# EasyEDA Pro project 校内赛载板最终版.eprj

# Schematic Schematic1
Board Name: Board1; Create Date: 2024-11-15; Page Name: P1; Project Name: 校内赛载板; Schematic Name: Schematic1; Update Date: 2024-12-04; Company: 韩广洋; Page Size: A4; Version: V1.0
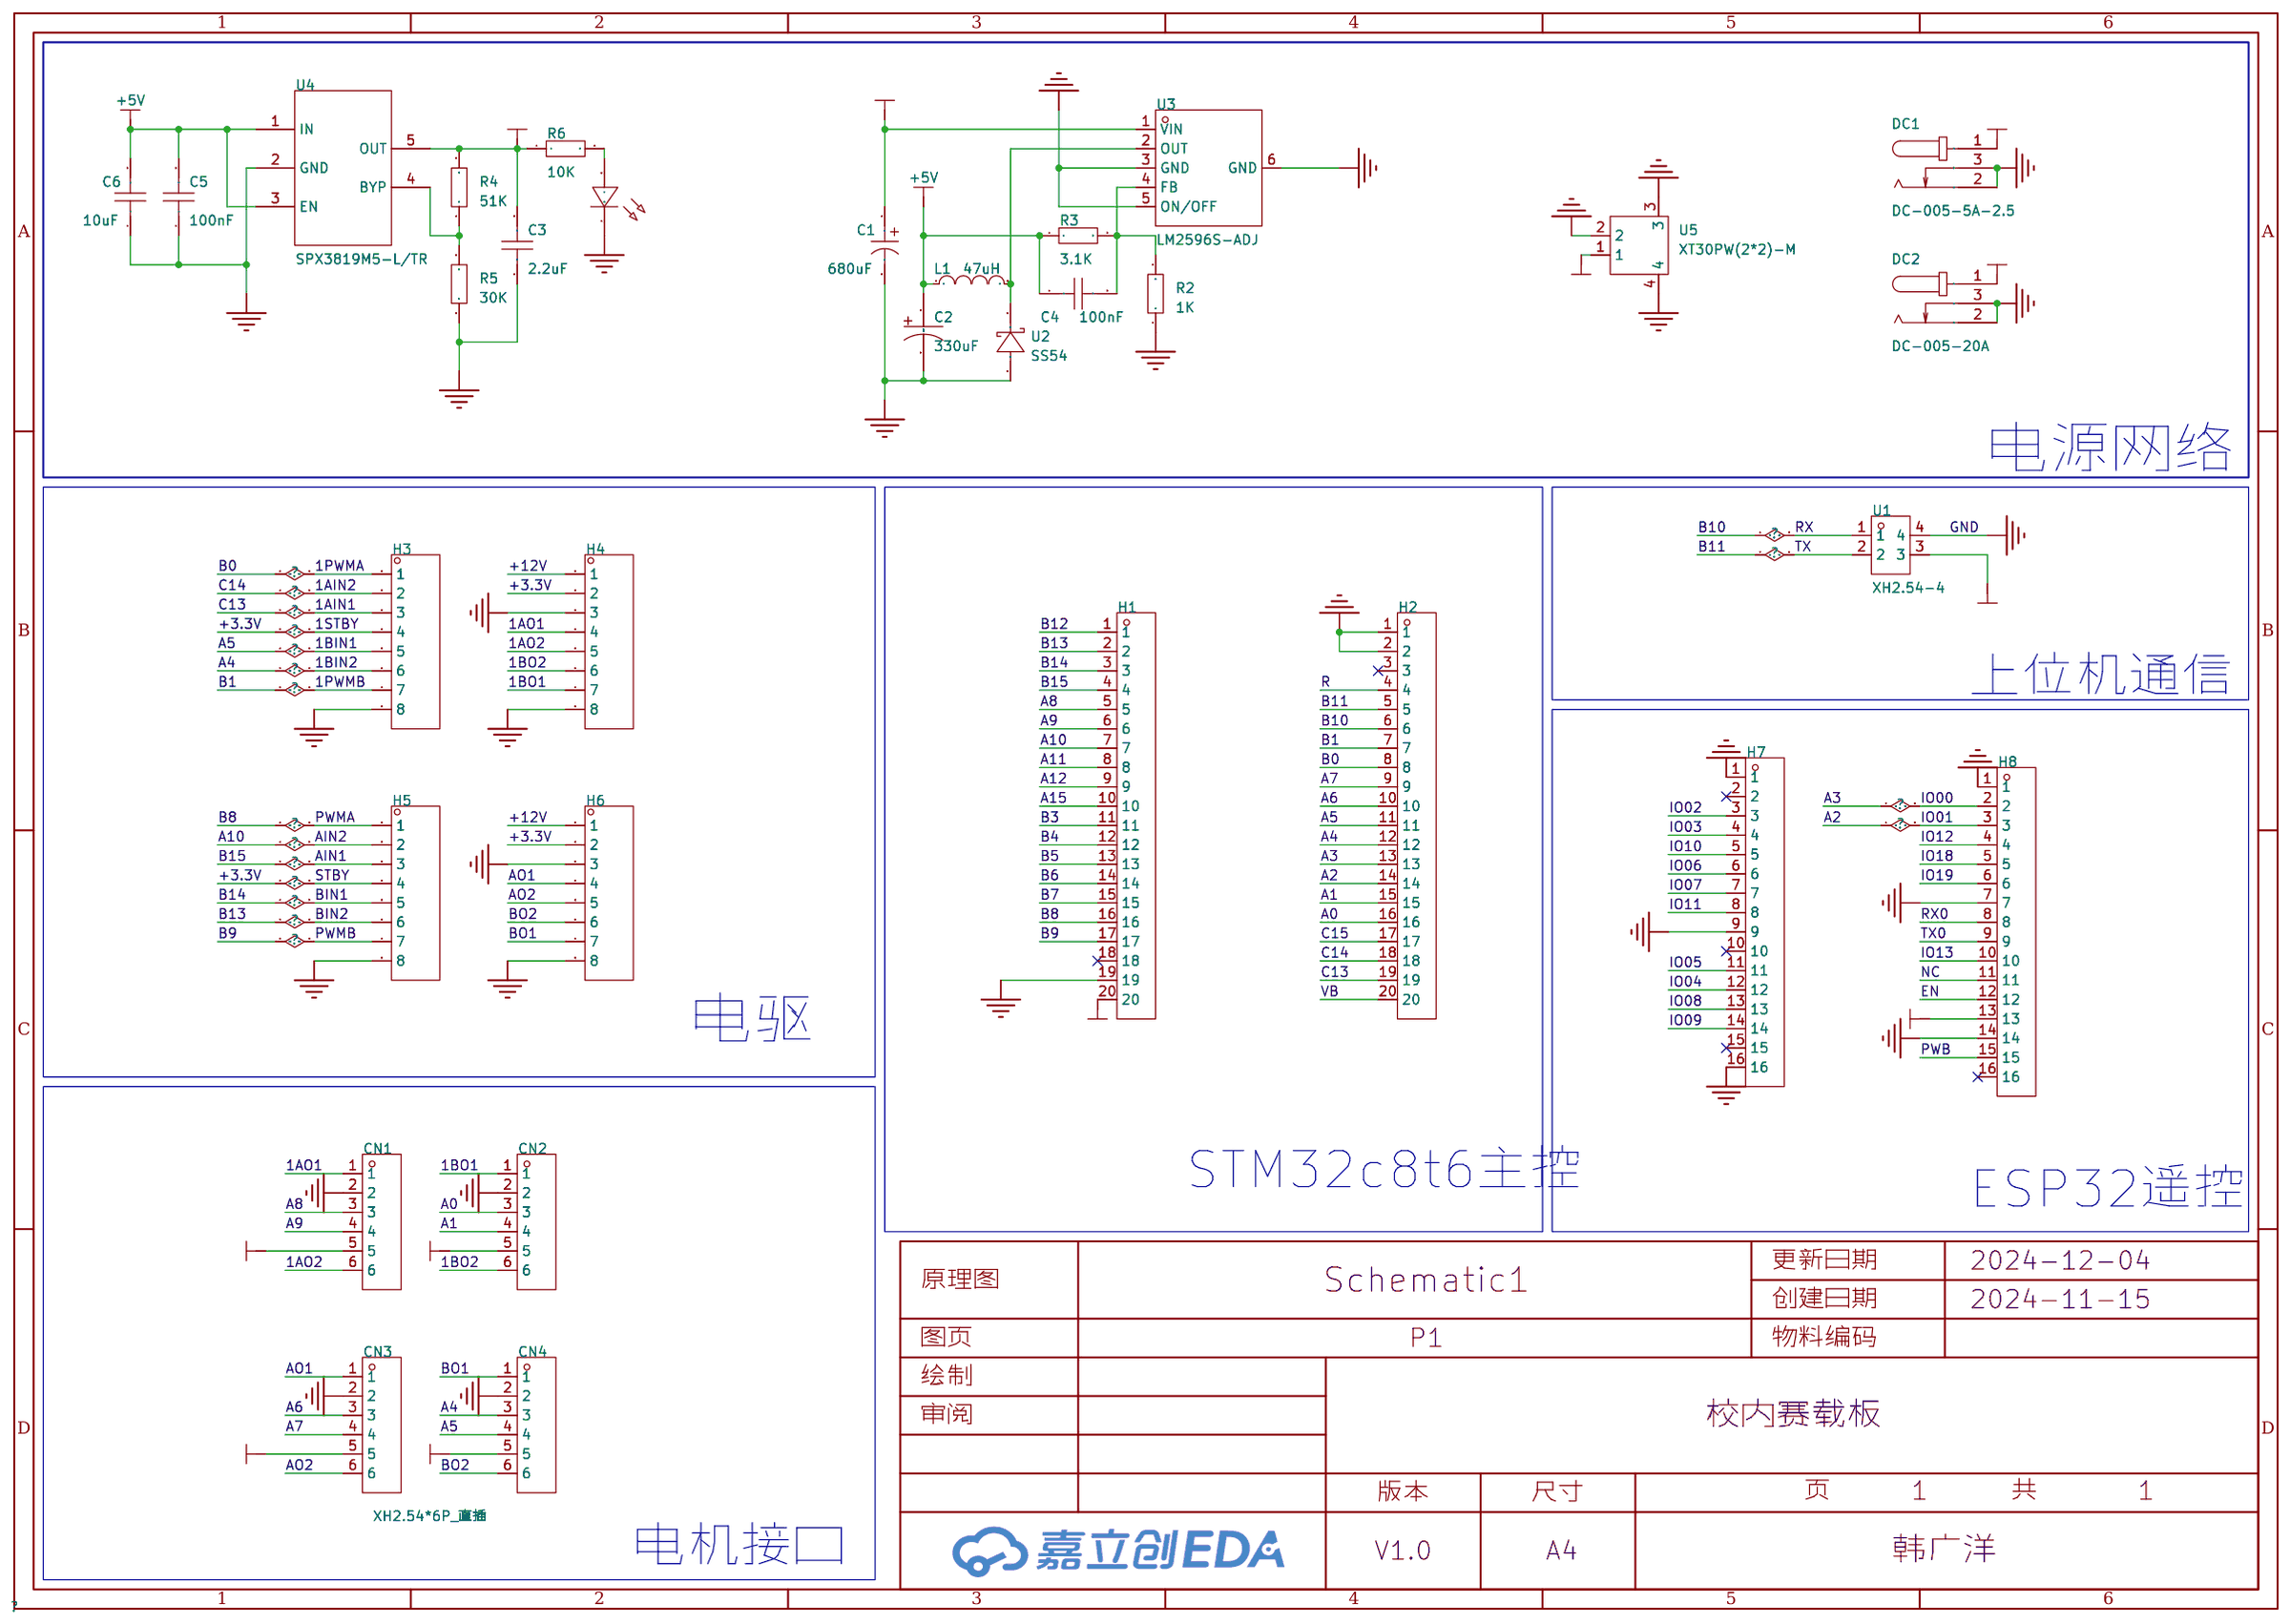
[diagram p0: schematic sheet]

## Parts
C1  680uF  [CAP-SMD_BD16.0-L17.0-W17.0-LS18.0-FD]
C2  330uF  [CAP-SMD_BD8.0-L8.3-W8.3-LS9.3-FD-1]
C3  2.2uF  [C0603]
C4  100nF  [C0603]
C5  100nF  [C0603]
C6  10uF  [C0603]
CN1  XH2.54*6P_直插  [CONN-TH_XH2.54-6P]
CN2  XH2.54*6P_直插  [CONN-TH_XH2.54-6P]
CN3  XH2.54*6P_直插  [CONN-TH_XH2.54-6P]
CN4  XH2.54*6P_直插  [CONN-TH_XH2.54-6P]
DC1  DC-005-5A-2.5  [DC-IN-TH_DC-005-5A-2.5]
DC2  DC-005-20A  [DC-IN-TH_DC005]
H1  -  [HDR-TH_20P-P2.54-V-M-1]
H2  -  [HDR-TH_20P-P2.54-V-M-1]
H3  -  [HDR-TH_8P-P2.54-V-M]
H4  -  [HDR-TH_8P-P2.54-V-M]
H5  -  [HDR-TH_8P-P2.54-V-M]
H6  -  [HDR-TH_8P-P2.54-V-M]
H7  -  [HDR-TH_16P-P2.54-V-M]
H8  -  [HDR-TH_16P-P2.54-V-M]
L1  47uH  [IND-SMD_L11.5-W10.0_SMMS1040]
power1  -  [LED_0603]
R2  1K  [R0603]
R3  3.1K  [R0603]
R4  51K  [R0603]
R5  30K  [R0603]
R6  10K  [R0603]
U1  XH2.54-4  [CONN-TH_4P-P2.50_XH2.54-4]
U2  SS54  [SMB_L4.3-W3.6-LS5.4-RD]
U3  LM2596S-ADJ  [TO-263-5_L10.0-W8.4-P1.70-LS15.3-BR]
U4  SPX3819M5-L/TR  [SOT-23-5_L3.0-W1.7-P0.95-LS2.8-TL]
U5  XT30PW(2*2)-M  [CONN-TH_XT30PW-M]

## Library data of the parts
C1 = EEVFK1H681M: 容值:680uF;精度:±20%;额定电压:50V;纹波电流:1.208A@120Hz;等效串联电阻:-;; LCSC Part Name: 680uF ±20% 50V; Supplier Part: C401970; Manufacturer: PANASONIC(松下); Supplier Footprint: SMD; JLCPCB Part Class: 扩展库; Datasheet: https://atta.szlcsc.com/upload/public/pdf/source/20190702/C401970_913ED576C1BD808CA41B229867A4EED0.pdf; Supplier: LCSC; Tolerance: ±20%; Rated Voltage: 50V; Ripple Current: 1.208A@120Hz; Lifetime @ Temp: 5000hrs@105℃; Operating Temperature: -55℃~+105℃
C2 = RVT1E331M0810_C335985: 容值:330uF;精度:±20%;额定电压:25V;纹波电流:228mA@120Hz;等效串联电阻:-;; LCSC Part Name: 330uF ±20% 25V; Supplier Part: C335985; Manufacturer: ROQANG(容强); Manufacturer Part: RVT1E331M0810; Supplier Footprint: SMD,D8xL10.2mm; Datasheet: https://atta.szlcsc.com/upload/public/pdf/source/20181128/C335987_23CA7AA50FB42690DF736C43FE112376.pdf; Supplier: LCSC; Tolerance: ±20%; Rated Voltage: 25V; Ripple Current: 228mA@120Hz; φD: 8mm; L: 10.2mm; Lifetime @ Temp: 2000hrs@105℃; Operating Temperature: -40℃~+105℃
C3-C6 = CAP_0603: Supplier Footprint: 0603
CN1-CN4 = XH2.54*6P_直插: Supplier Part: C9900008614; Supplier Footprint: XH2.54_6P; JLCPCB Part Class: 扩展库; Supplier: LCSC
DC1 = DC-005-5A-2.5: LCSC Part Name: DC电源插座 内径:2.5mm 外径:6.5mm; Supplier Part: C381115; Manufacturer: XKB Connection(中国星坤); Supplier Footprint: 插件; JLCPCB Part Class: 扩展库; Datasheet: https://atta.szlcsc.com/upload/public/pdf/source/20220930/9F6B678D272419D8FE16D336E354A545.pdf; Supplier: LCSC; Connector Type: DC电源插座; Mounting Style: 弯插; Inside Contact Diameter: 2.5mm; Outside Contact Diameter: 6.5mm; Current Rating (Max): 5A; Voltage Rating (Max): 24V; Operating Temperature Range: -20℃~+70℃
DC2 = DC-005-20A: LCSC Part Name: DC电源插座 内径:2mm 外径:6.4mm; Supplier Part: C130239; Manufacturer: 韩国韩荣; Supplier Footprint: 插件; JLCPCB Part Class: 扩展库; Datasheet: https://atta.szlcsc.com/upload/public/pdf/source/20210810/D1FE451D887B1804F0660F580C4AD849.pdf; Supplier: LCSC; Connector Type: DC电源插座; Mounting Style: 弯插; Inside Contact Diameter: 2mm; Outside Contact Diameter: 6.4mm; Current Rating (Max): 500mA; Voltage Rating (Max): 30V; Operating Temperature Range: -25℃~+80℃
H1 H2 = HDR-M_2.54_1x20P: Supplier Part: C50981; Supplier Footprint: 插件
H3-H6 = HDR-M_2.54_1x8P: Supplier Part: C124381; Supplier Footprint: 插件
H7 H8 = HDR-M_2.54_1x16P: Supplier Part: C2894939; Supplier Footprint: 插件
L1 = SMMS1040-470M: 电感值:47uH;精度:±20%;额定电流:3A;饱和电流(Isat):4.5A;类型:一体成型电感;; LCSC Part Name: 47uH ±20% 4.5A; Supplier Part: C149599; Manufacturer: SXN(顺翔诺); JLCPCB Part Class: 扩展库; Datasheet: https://atta.szlcsc.com/upload/public/pdf/source/20210810/BBF24330FB2F5029F637830BA9C42C0D.pdf; Supplier: LCSC; Tolerance: ±20%; Rated Current: 3A; Saturation Current (Isat): 4.5A; DC Resistance (DCR): 155mΩ; Type: 一体成型电感
power1 = LED_0603-B: Supplier Footprint: 0603
R2-R6 = Res_0603: Supplier Footprint: 0603
U1 = XH2.54-4_C9900009491: Supplier Part: C9900009491; Supplier Footprint: RS485接口; JLCPCB Part Class: 扩展库; Supplier: LCSC
U2 = SS54_C5200096: 二极管配置:独立式;正向压降(Vf):550mV@5A;直流反向耐压(Vr):40V;整流电流:5A;; LCSC Part Name: 电压:40V 电流:5A; Supplier Part: C5200096; Manufacturer: HXY MOSFET(华轩阳电子); Supplier Footprint: SMB; JLCPCB Part Class: 扩展库; Datasheet: https://atta.szlcsc.com/upload/public/pdf/source/20240729/0CDBC9DF1EA9FCC08D6B1D5092B6FBD2.pdf; Supplier: LCSC; Diode Configuration: 独立式; Forward Voltage (Vf@If): 550mV@5A; Reverse Voltage (Vr): 40V; Rectified Current: 5A; Reverse Leakage Current (Ir): 500uA
U3 = LM2596S-ADJ_C5349987: 功能类型:降压型;输出类型:可调;输入电压:40V;输出电压:1.23V~37V;输出电流(最大值):3.5A;; Supplier Part: C5349987; Manufacturer: HXY MOSFET(华轩阳电子); Supplier Footprint: TO-263-5L; JLCPCB Part Class: 扩展库; Datasheet: https://atta.szlcsc.com/upload/public/pdf/source/20230111/199BC35A7A4D0647B85E7DE5CE9FEA7F.pdf; Supplier: LCSC; Function: 降压型; Output Type: 可调; Input Voltage: 40V; Output Voltage: 1.23V~37V; Output Current (Max): 3.5A; Operating Temperature: -40℃~+125℃; Number of Outputs: 1; Switch tube (built-in/external): 内置
U4 = SPX3819M5-L/TR: 输出类型:可调;输出极性:正;输出通道数:1;最大输入电压:16V;输出电压:1.235V~15.3V;压差:700mV@(500mA);输出电流:500mA;电源纹波抑制比(PRSS):-;; LCSC Part Name: Vin=16V Vout=1.235V~15.3V 500mA; Supplier Part: C9056; Manufacturer: MaxLinear; Supplier Footprint: SOT-23-5; JLCPCB Part Class: Extended Part; Datasheet: https://atta.szlcsc.com/upload/public/pdf/source/20170918/C9056_1505727077801976524.pdf; Supplier: LCSC; Output Type: 可调; Output Polarity: 正; Number of Outputs: 1; Maximum Input Voltage: 16V; Output Voltage: 1.235V~15.3V; Dropout Voltage: 700mV@(500mA); Output Current: 500mA
U5 = XT30PW(2*2)-M: Supplier Part: C9900097120; JLCPCB Part Class: 扩展库; Supplier: LCSC

## Nets
+3.3V: C3.2 CN1.5 CN2.5 CN3.5 CN4.5 H1.20 H3.4 H4.2 H5.4 H6.2 H8.13 R4.2 R6.1 U1.3 U4.5(OUT)
+5V: C2.1 C4.1 C5.2 C6.2 L1.1 R3.1 U4.1(IN) U4.3(EN)
+12V: C1.1 DC1.1 DC2.1 H4.1 H6.1 U3.1(VIN) U5.1
GND: C1.2 C2.2 C3.1 C5.1 C6.1 CN1.2 CN2.2 CN3.2 CN4.2 DC1.2 DC1.3 DC2.2 DC2.3 H1.19 H2.1 H2.2 H3.8 H4.3 H4.8 H5.8 H6.3 H6.8 H7.1 H7.9 H7.16 H8.1 H8.7 H8.14 power1.1(C) R2.1 R5.1 U1.4 U2.2 U3.3(GND) U3.5(ON/OFF) U3.6(GND) U4.2(GND) U5.2 U5.3 U5.4
1AIN1: H2.19 H3.3
1AIN2: H2.18 H3.2
1AO1: CN1.1 H4.4
1AO2: CN1.6 H4.5
1BIN1: CN4.4 H2.11 H3.5
1BIN2: CN4.3 H2.12 H3.6
1BO1: CN2.1 H4.7
1BO2: CN2.6 H4.6
1PWMA: H2.8 H3.1
1PWMB: H2.7 H3.7
A0: CN2.3 H2.16
A1: CN2.4 H2.15
A2: H2.14 H8.3
A3: H2.13 H8.2
A6: CN3.3 H2.10
A7: CN3.4 H2.9
A8: CN1.3 H1.5
A9: CN1.4 H1.6
A10: H1.7 H5.2
A11: H1.8
A12: H1.9
A15: H1.10
AIN1: H1.4 H5.3
AO1: CN3.1 H6.4
AO2: CN3.6 H6.5
B3: H1.11
B4: H1.12
B5: H1.13
B6: H1.14
B7: H1.15
B8: H1.16 H5.1
B9: H1.17 H5.7
B10: H2.6 U1.1
B11: H2.5 U1.2
B12: H1.1
B13: H1.2 H5.6
B14: H1.3 H5.5
BO1: CN4.1 H6.7
BO2: CN4.6 H6.6
C15: H2.17
EN: H8.12
IO02: H7.3
IO03: H7.4
IO04: H7.12
IO05: H7.11
IO06: H7.6
IO07: H7.7
IO08: H7.13
IO09: H7.14
IO10: H7.5
IO11: H7.8
IO12: H8.4
IO13: H8.10
IO18: H8.5
IO19: H8.6
NC: H8.11
PWB: H8.15
R: H2.4
RX0: H8.8
TX0: H8.9
VB: H2.20
$1N12002: L1.2 U2.1 U3.2(OUT)
$1N12004: C4.2 R2.2 R3.2 U3.4(FB)
$1N12294: R4.1 R5.2 U4.4(BYP)
$1N12610: power1.2(A) R6.2

Not connected (* = marked no-connect by the designer): H1 18*; H2 3*; H7 2* 10* 15*; H8 16*

## Notes on the sheet
- 电源网络
- 上位机通信
- 电驱
- STM32c8t6主控
- ESP32遥控
- 电机接口

# Board PCB1
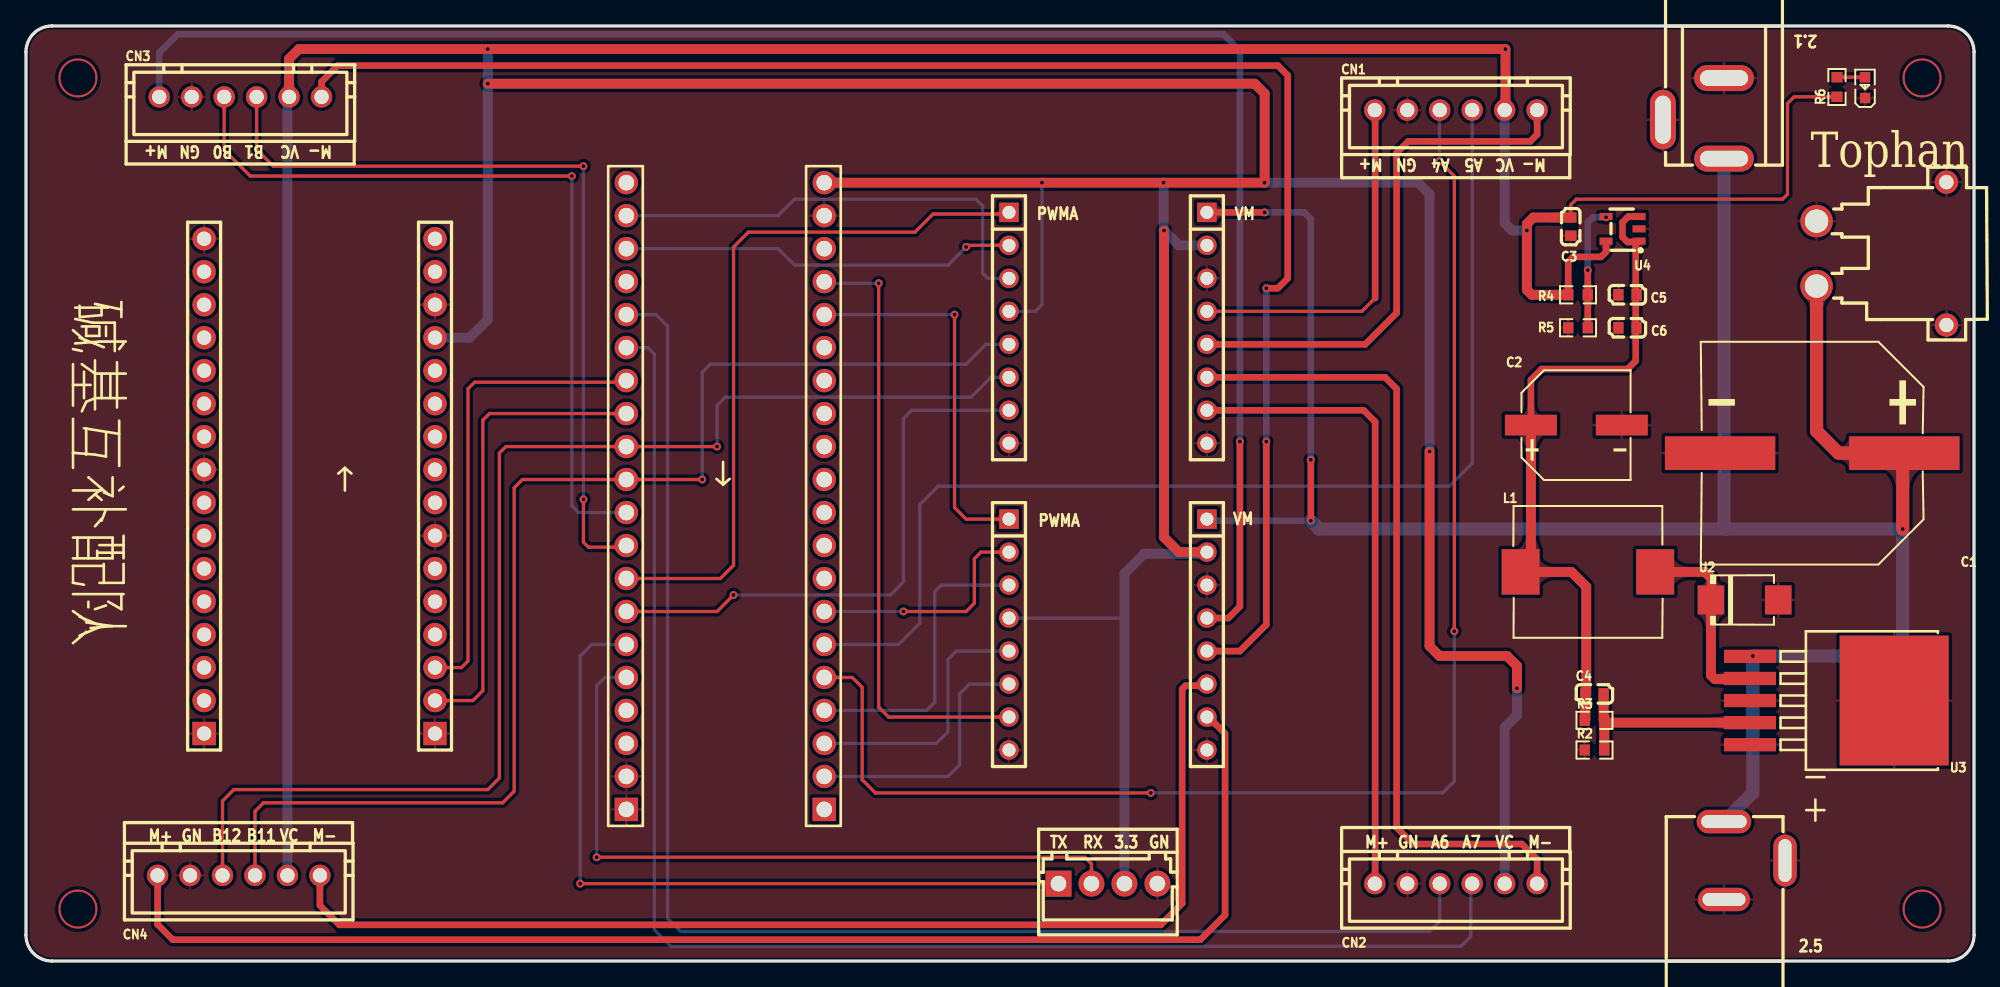
[diagram p1: board, top side]
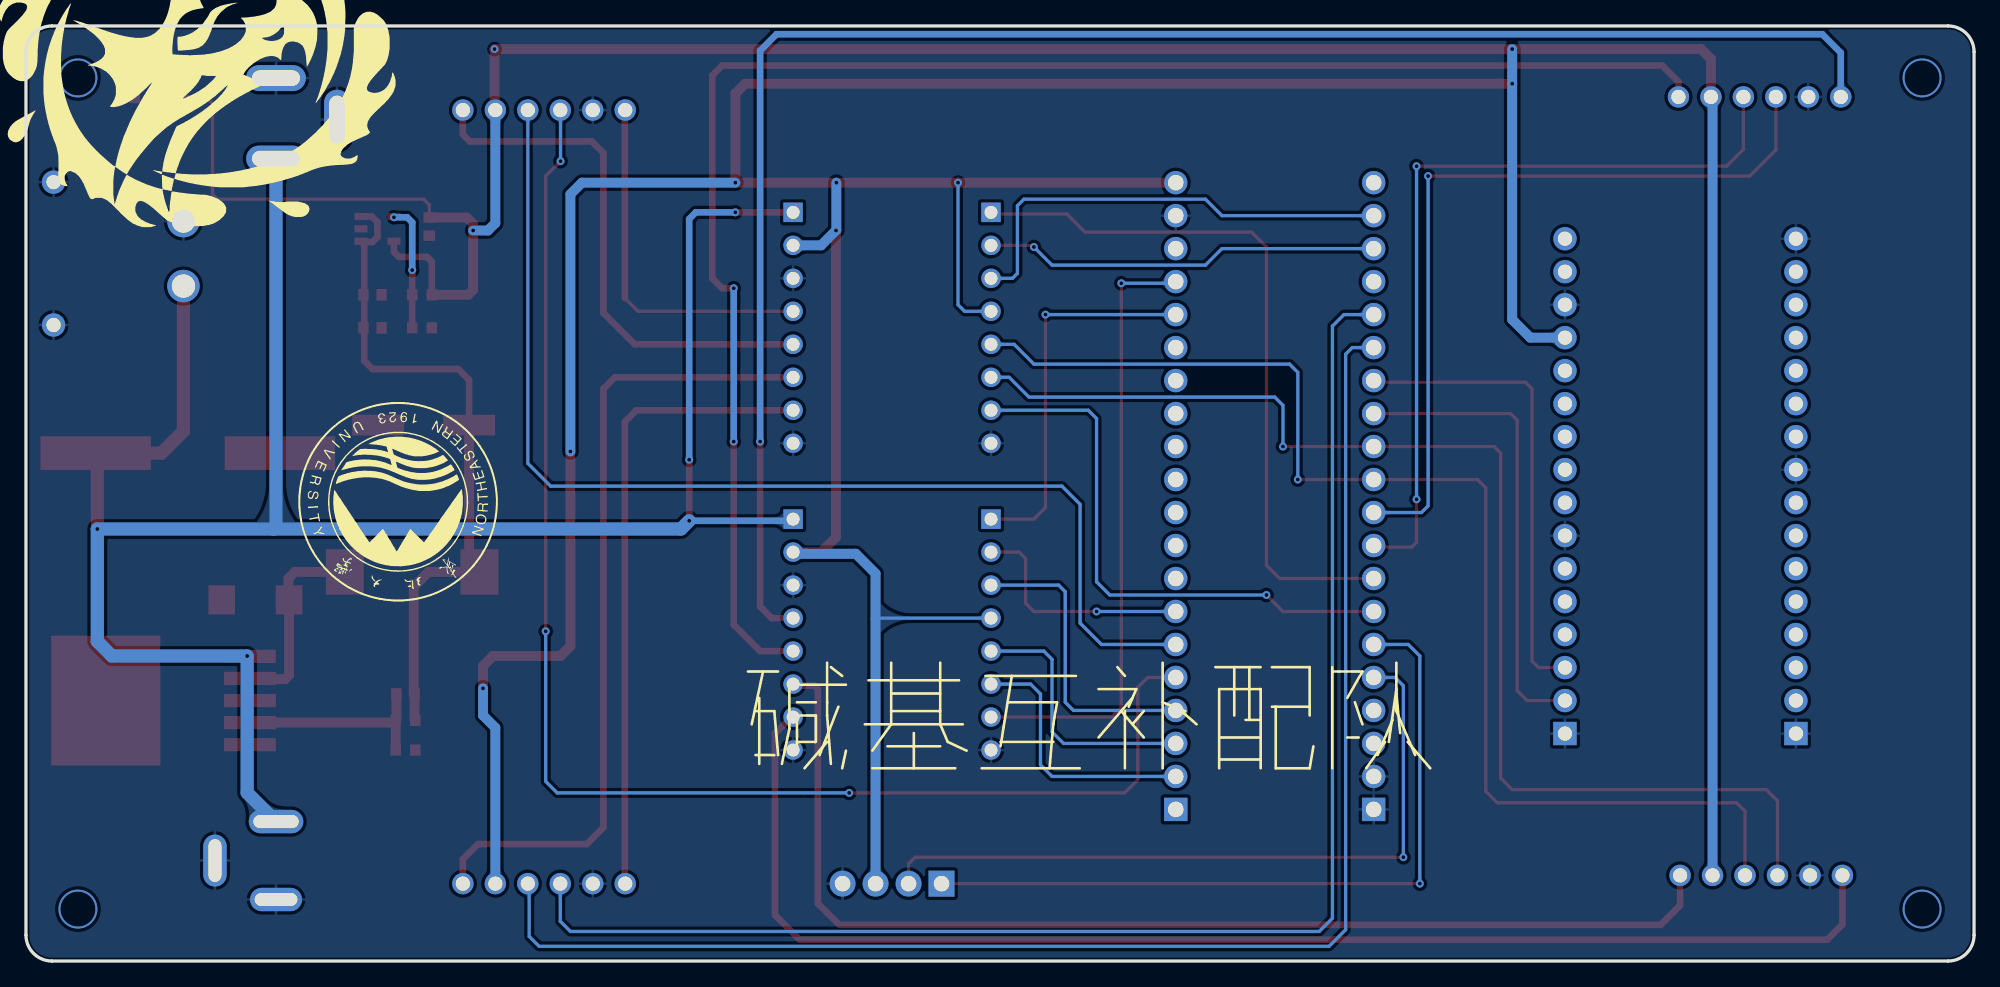
[diagram p2: board, bottom side, seen from below]

Outline 150 x 72 mm; copper layers: Top Layer, Bottom Layer. Coordinates in mm from the lower left corner of the outline.
Outline path: 0,70 0,2 arc(0.59,0.59) 2,0 148,0 arc(149.41,0.59) 150,2 150,70 arc(149.41,71.41) 148,72 2,72 arc(0.59,71.41) 0,70
Stack: Top Layer 0.035mm / Dielectric1 1.51mm FR4 er 4.5 / Bottom Layer 0.035mm

## Design rules (mm)
template: JLCPCB Capability(Two Layers Board)
spacing copperThickness1oz (default): track to track 0.102, other pairs 0.152 to 0.3
spacing copperThickness2oz: track to track 0.203, other pairs 0.152 to 0.3
track width copperThickness1oz (default): min 0.127, default 0.254, max 2.54
track width copperThickness2oz: min 0.203, default 0.254, max 2.54
differential pair differentialPair (default): width min 0.127, default 0.254, max 2.54; gap min 0.152, default 0.152
via viaSize (default): diameter min 0.5, default 0.61, max 10; hole min 0.3, default 0.305, max 6.3

## Placement (name value [footprint] x y rotation side)
C1  680uF  [CAP-SMD_BD16.0-L17.0-W17.0-LS18.0-FD]  137.54 39.11 180 top
C2  330uF  [CAP-SMD_BD8.0-L8.3-W8.3-LS9.3-FD-1]  119.38 41.27 0 top
C3  2.2uF  [C0603]  118.95 56.55 90 top
C4  100nF  [C0603]  120.78 20.56 0 top
C5  100nF  [C0603]  123.32 51.3 0 top
C6  10uF  [C0603]  123.32 48.76 0 top
CN1  XH2.54*6P_直插  [CONN-TH_XH2.54-6P]  110.11 65.52 0 top
CN2  XH2.54*6P_直插  [CONN-TH_XH2.54-6P]  110.11 5.96 0 top
CN3  XH2.54*6P_直插  [CONN-TH_XH2.54-6P]  16.51 66.54 0 top
CN4  XH2.54*6P_直插  [CONN-TH_XH2.54-6P]  16.38 6.59 0 top
DC1  DC-005-5A-2.5  [DC-IN-TH_DC-005-5A-2.5]  133.1 7.74 90 top
DC2  DC-005-20A  [DC-IN-TH_DC005]  128.4 64.89 270 top
H1  -  [HDR-TH_20P-P2.54-V-M-1]  61.47 35.81 90 top
H2  -  [HDR-TH_20P-P2.54-V-M-1]  46.23 35.81 90 top
H3  -  [HDR-TH_8P-P2.54-V-M]  75.69 48.76 270 top
H4  -  [HDR-TH_8P-P2.54-V-M]  90.93 48.76 270 top
H5  -  [HDR-TH_8P-P2.54-V-M]  75.69 25.14 270 top
H6  -  [HDR-TH_8P-P2.54-V-M]  90.93 25.14 270 top
H7  -  [HDR-TH_16P-P2.54-V-M]  13.72 36.57 90 top
H8  -  [HDR-TH_16P-P2.54-V-M]  31.5 36.57 90 top
L1  47uH  [IND-SMD_L11.5-W10.0_SMMS1040]  120.27 29.96 0 top
power1  -  [LED_0603]  141.6 67.3 90 top
R2  1K  [R0603]  120.78 16.25 0 top
R3  3.1K  [R0603]  120.78 18.53 0 top
R4  51K  [R0603]  119.51 51.3 180 top
R5  30K  [R0603]  119.51 48.76 0 top
R6  10K  [R0603]  139.45 67.3 90 top
U1  XH2.54-4  [CONN-TH_4P-P2.50_XH2.54-4]  83.31 5.96 0 top
U2  SS54  [SMB_L4.3-W3.6-LS5.4-RD]  132.33 27.8 0 top
U3  LM2596S-ADJ  [TO-263-5_L10.0-W8.4-P1.70-LS15.3-BR]  138.3 20.06 180 top
U4  SPX3819M5-L/TR  [SOT-23-5_L3.0-W1.7-P0.95-LS2.8-TL]  122.94 56.38 180 top
U5  XT30PW(2*2)-M  [CONN-TH_XT30PW-M]  142.88 54.47 90 top

## Footprints (pads in the part's own frame, mm; a bottom-side part is the same pattern mirrored in y, then rotated)
C0603
  rect 0.8x0.9 smd: 1(-0.7,0) 2(0.7,0)
CAP-SMD_BD8.0-L8.3-W8.3-LS9.3-FD-1
  rect 4x1.6 smd: 1(-3.5,0) 2(3.5,0)
CAP-SMD_BD16.0-L17.0-W17.0-LS18.0-FD
  rect 8.5x2.6 smd: 1(-7.093,0) 2(7.093,0)
CONN-TH_4P-P2.50_XH2.54-4
  rect 2x2 hole 1.2: 1(-3.81,0)
  round 2 hole 1.2: 2(-1.27,0) 3(1.27,0) 4(3.81,0)
CONN-TH_XH2.54-6P
  round 1.65 hole 1.1: 1(-6.25,0) 2(-3.75,0) 3(-1.25,0) 4(1.25,0) 5(3.75,0) 6(6.25,0)
CONN-TH_XT30PW-M
  round 2.5 hole 1.8: 1(-2.5,5) 2(2.5,5)
  round 1.8 hole 1.1: 3(5.5,-5) 4(-5.5,-5)
DC-IN-TH_DC005
  oval 2x4.6 hole 1.2x3.7: 1(3.1,2.35) 2(-3.1,2.35)
  oval 4.6x2 hole 3.7x1.2: 3(0.1,-2.35)
DC-IN-TH_DC-005-5A-2.5
  oval 1.8x4.2 hole 1x3.5: 1(3,2.352)
  oval 1.8x4 hole 1x3.3: 2(-3,2.352)
  oval 4x1.8 hole 3.3x1: 3(-0.001,-2.352)
HDR-TH_8P-P2.54-V-M
  rect 1.5x1.5 hole 1: 1(-8.89,0)
  round 1.5 hole 1: 2(-6.35,0) 3(-3.81,0) 4(-1.27,0) 5(1.27,0) 6(3.81,0) 7(6.35,0) 8(8.89,0)
HDR-TH_16P-P2.54-V-M
  rect 1.8x1.8 hole 1.1: 1(-19.05,0)
  round 1.8 hole 1.1: 2(-16.51,0) 3(-13.97,0) 4(-11.43,0) 5(-8.89,0) 6(-6.35,0) 7(-3.81,0) 8(-1.27,0) 9(1.27,0) 10(3.81,0) 11(6.35,0) 12(8.89,0) 13(11.43,0) 14(13.97,0) 15(16.51,0) 16(19.05,0)
HDR-TH_20P-P2.54-V-M-1
  rect 1.8x1.8 hole 1.2: 1(-24.13,0)
  round 1.8 hole 1.2: 2(-21.59,0) 3(-19.05,0) 4(-16.51,0) 5(-13.97,0) 6(-11.43,0) 7(-8.89,0) 8(-6.35,0) 9(-3.81,0) 10(-1.27,0) 11(1.27,0) 12(3.81,0) 13(6.35,0) 14(8.89,0) 15(11.43,0) 16(13.97,0) 17(16.51,0) 18(19.05,0) 19(21.59,0) 20(24.13,0)
IND-SMD_L11.5-W10.0_SMMS1040
  rect 2.924x3.5 smd: 1(-5.181,0) 2(5.181,0)
LED_0603
  rect 0.8x0.8 smd: 1(-0.851,-0.01) 2(0.75,-0.005)
R0603
  rect 0.806x0.864 smd: 1(-0.753,0) 2(0.753,0)
SMB_L4.3-W3.6-LS5.4-RD
  rect 2.047x2.241 smd: 1(-2.591,0) 2(2.591,0)
SOT-23-5_L3.0-W1.7-P0.95-LS2.8-TL
  rect 1x0.55 smd: 1(-1.272,0.95) 2(-1.272,0) 3(-1.272,-0.95) 4(1.272,-0.95) 5(1.272,0.95)
TO-263-5_L10.0-W8.4-P1.70-LS15.3-BR
  rect 4x1.02 smd: 1(5.55,-3.4) 2(5.55,-1.7) 3(5.55,0) 4(5.55,1.7) 5(5.55,3.4)
  rect 8.4x10 smd: 6(-5.55,0)

## Nets
As in the schematic.

Pads without a net: H1 18; H2 3; H7 2 10 15; H8 16

## Via types
v1: diameter 3, hole 2.7, Top Layer to Bottom Layer, 4 vias
v2: diameter 0.61, hole 0.305, Top Layer to Bottom Layer, 35 vias

## Routing (per net, layer and track width the routed paths; a pad name or vN(x,y) marks a point on that pad's centre or on a via; arc(x,y) is an arc through that point)
+3.3V: length 505.5
  Top Layer w0.254: C3.2 118.95,58.23 119.38,58.67 135.25,58.67 135.64,59.05 135.64,66.03 136.15,66.55 R6.1
  Top Layer w0.508: R4.2 118.75,53.85 119.13,54.22 121.28,54.22 121.67,54.6 121.67,55.43
  Top Layer w0.762: H1.20 v2(78.23,59.94) v2(87.6,59.94) v2(95.38,59.94) 95.38,66.79 94.62,67.56 v2(35.56,67.56) ; CN3.5 20.26,69.47 21.02,70.22 v2(35.56,70.22) v2(113.92,70.22) 113.92,65.71 113.86,65.65 CN1.5 ; C3.2 116.06,57.25 115.57,56.76 v2(115.57,56.25) 115.57,51.68 115.95,51.3 R4.2 ; v2(87.63,56.25) 87.63,32.63 88.77,31.49 H6.2 ; v2(114.81,21) 114.81,22.72 114.05,23.49 108.84,23.49 108.08,24.25 v2(108.08,39.23)
  Bottom Layer w0.254: H5.4 84.53,26.41 84.58,26.36 ; v2(78.23,59.94) 78.23,50.54 77.72,50.03 H3.4
  Bottom Layer w0.762: v2(108.08,39.23) 108.08,59.05 107.19,59.94 v2(95.38,59.94) ; CN2.5 113.86,17.97 114.81,18.91 v2(114.81,21) ; v2(87.6,59.94) 87.6,56.28 88.77,55.11 H4.2 ; CN3.5 20.13,66.41 CN4.5 ; CN1.5 113.86,56.82 114.43,56.25 v2(115.57,56.25) ; H6.2 90.81,31.36 86.11,31.36 84.58,29.84 U1.3 ; v2(35.56,70.22) v2(35.56,67.56) 35.56,49.39 34.16,48 H8.13
+5V: length 52.9
  Top Layer w0.508: 124.21,57.33 123.38,57.33 122.94,56.89 122.94,55.74 123.32,55.36 124.14,55.36 ; 124.14,55.36 123.95,55.17 123.95,46.22 123.32,45.58 116.71,45.58 115.88,44.75 C2.1 ; 124.14,55.36 U4.1
  Top Layer w0.762: C2.1 115.88,30.75 L1.1 119,29.96 120.14,28.82 120.14,20.63 C4.1 120.08,18.59 R3.1
+12V: length 172.8
  Top Layer w0.508: v2(98.93,38.6) v2(98.93,33.9) ; H4.1 v2(95.38,57.65)
  Top Layer w1.016: v2(144.51,33.27) 144.51,38.98 C1.1 139.57,39.11 137.88,40.81 U5.1
  Bottom Layer w0.508: v2(95.38,57.65) 98.43,57.65 98.93,57.14 v2(98.93,38.6) ; H6.1 91.06,33.9 v2(98.93,33.9)
  Bottom Layer w1.016: DC1.1 132.97,12.96 v2(132.97,23.49) 143.38,23.49 144.51,24.61 v2(144.51,33.27) 130.92,33.27 ; 130.92,33.27 130.75,33.44 DC2.1 ; 130.92,33.27 99.57,33.27 v2(98.93,33.9)
(no net):
  vias: v1(4,68) v1(4,4) v1(146,68) v1(146,4)
1AIN1: length 35.6
  Bottom Layer w0.254: H3.3 74.04,52.57 73.66,52.95 73.66,58.16 73.15,58.67 59.18,58.67 57.91,57.39 H2.19
1AIN2: length 30.6
  Top Layer w0.254: v2(72.39,54.98) 72.52,55.11 H3.2
  Bottom Layer w0.254: v2(72.39,54.98) 70.99,53.58 59.18,53.58 57.91,54.86 H2.18
1AO1: length 27.9
  Top Layer w0.254: H4.4 102.87,50.03 103.89,51.05 ; 103.89,65.5 CN1.1
  Top Layer w0.508: 103.89,51.05 103.89,65.5
1AO2: length 41.2
  Top Layer w0.508: CN1.6 116.36,63.64 115.82,63.11 106.43,63.11 105.54,62.22 105.54,49.9 103.12,47.49 H4.5
1BIN1: length 96.4
  Top Layer w0.254: v2(52.07,37.08) H2.11 38.23,37.08 37.59,36.44 37.59,13.07 36.7,12.18 18.29,12.18 17.63,11.53 CN4.4
  Bottom Layer w0.254: H3.5 73.91,47.49 72.39,45.97 52.7,45.97 52.07,45.33 v2(52.07,37.08)
1BIN2: length 96.3
  Top Layer w0.254: CN4.3 15.13,12.33 16,13.2 35.56,13.2 36.45,14.09 36.45,39.11 36.96,39.61 H2.12 v2(53.21,39.61)
  Bottom Layer w0.254: H3.6 74.29,44.95 72.77,43.42 53.85,43.42 53.21,42.79 v2(53.21,39.61)
1BO1: length 48.9
  Top Layer w0.508: 103.99,5.96 103.89,6.06 103.89,41.52 103,42.41 H4.7
1BO2: length 62.5
  Top Layer w0.508: CN2.6 116.36,7.84 115.19,9.01 106.81,9.01 105.54,10.28 105.54,44.06 104.65,44.95 H4.6
1PWMA: length 55.5
  Top Layer w0.254: H2.8 53.47,29.45 54.48,30.47 54.48,54.98 55.63,56.12 68.45,56.12 69.85,57.52 75.56,57.52 H3.1
1PWMB: length 43.2
  Top Layer w0.254: v2(54.48,28.19) 53.21,26.92 H2.7
  Bottom Layer w0.254: v2(54.48,28.19) 66.55,28.19 67.56,29.2 67.56,41.77 68.2,42.41 H3.7
A0: length 112.2
  Bottom Layer w0.254: CN2.3 108.86,3.06 108.08,2.28 50.42,2.28 49.4,3.29 49.4,48.89 48.51,49.78 H2.16
A1: length 114.5
  Bottom Layer w0.254: CN2.4 111.25,5.85 111.25,1.9 110.49,1.13 49.66,1.13 48.39,2.4 48.39,46.73 47.88,47.23 H2.15
A2: length 36.2
  Top Layer w0.254: H8.3 33.53,22.6 34.04,23.11 34.04,44.06 34.54,44.57 46.1,44.57 H2.14
A3: length 36.1
  Top Layer w0.254: H2.13 35.69,42.16 35.18,41.65 35.18,20.82 34.42,20.06 H8.2
A6: length 61.5
  Top Layer w0.254: v2(42.04,60.44) 17.27,60.44 15.26,62.45 CN3.3
  Bottom Layer w0.254: H2.10 42.55,34.53 42.04,35.04 v2(42.04,60.44)
A7: length 62.2
  Top Layer w0.254: H2.9 46.1,31.87 43.31,31.87 42.93,32.25 v2(42.93,35.55) ; v2(42.93,61.2) 19.05,61.2 17.76,62.5 CN3.4
  Bottom Layer w0.254: v2(42.93,61.2) v2(42.93,35.55)
A8: length 108.9
  Top Layer w0.254: v2(86.61,12.94) 65.41,12.94 64.39,13.96 64.39,21.07 63.63,21.83 H1.5 ; v2(108.84,61.59) 109.98,60.44 v2(109.98,25.39)
  Bottom Layer w0.254: v2(108.84,61.59) 108.84,65.5 CN1.3 ; v2(86.61,12.94) 109.09,12.94 109.98,13.83 v2(109.98,25.39)
A9: length 88.2
  Bottom Layer w0.254: H1.6 67.18,24.38 68.83,26.03 68.83,35.17 70.23,36.57 109.6,36.57 111.36,38.33 CN1.4
A10: length 18.1
  Top Layer w0.254: v2(67.56,26.92) 72.39,26.92 73.03,27.55 73.03,30.98 73.53,31.49 H5.2
  Bottom Layer w0.254: H1.7 v2(67.56,26.92)
AIN1: length 23.2
  Bottom Layer w0.254: H1.4 69.34,19.3 69.98,19.93 69.98,28.44 70.49,28.95 H5.3
AO1: length 133.4
  Top Layer w0.508: H6.4 92.58,26.41 93.47,27.3 v2(93.47,40)
  Bottom Layer w0.508: CN3.1 10.26,69.94 11.68,71.36 92.2,71.36 93.47,70.09 v2(93.47,40)
AO2: length 125.3
  Top Layer w0.508: H6.5 93.47,23.87 95.5,25.9 v2(95.5,40) ; v2(95.5,51.81) 96.39,51.81 97.16,52.57 97.16,68.19 96.39,68.95 24,68.95 22.76,67.71 CN3.6
  Bottom Layer w0.508: v2(95.5,51.81) v2(95.5,40)
B8: length 29.5
  Top Layer w0.254: v2(71.5,49.78) 71.5,34.92 72.39,34.03 H5.1
  Bottom Layer w0.254: v2(71.5,49.78) H1.16
B9: length 47.2
  Top Layer w0.254: H5.7 66.42,18.79 65.66,19.55 v2(65.66,52.19)
  Bottom Layer w0.254: v2(65.66,52.19) 61.59,52.19 H1.17
B10: length 58.3
  Top Layer w0.254: U1.1 v2(42.67,5.96)
  Bottom Layer w0.254: H2.6 43.56,24.38 42.67,23.49 v2(42.67,5.96)
B11: length 55.6
  Top Layer w0.254: U1.2 82.04,7.48 81.53,7.99 v2(43.94,7.99)
  Bottom Layer w0.254: v2(43.94,7.99) 43.94,21.2 44.58,21.83 H2.5
B13: length 20.4
  Bottom Layer w0.254: H5.6 72.64,21.33 71.88,20.56 71.88,15.1 70.99,14.22 H1.2
B14: length 20.4
  Bottom Layer w0.254: H1.3 70.1,16.75 70.99,17.64 70.99,23.23 71.63,23.87 H5.5
BO1: length 103.1
  Top Layer w0.508: H6.7 91.06,18.79 92.33,17.52 92.33,3.55 90.42,1.64 11.3,1.64 10.13,2.81 CN4.1
BO2: length 88.6
  Top Layer w0.508: CN4.6 22.63,4.28 24.13,2.78 87.38,2.78 89.03,4.44 89.03,20.95 89.28,21.2 90.81,21.2 H6.6
$1N12002: length 15.2
  Top Layer w0.762: U3.2 132.7,21.71 130.05,21.71 129.74,22.01 U2.1 129.79,27.86 129.79,29.45 129.29,29.96 L1.2
$1N12004: length 15.6
  Top Layer w0.762: R3.2 R2.2 ; R3.2 121.48,18.59 C4.2 ; R3.2 121.71,18.36 U3.4
$1N12294: length 9.7
  Top Layer w0.508: R5.2 R4.1 v2(120.26,53.2)
  Bottom Layer w0.508: v2(120.26,53.2) 120.26,56.88 120.65,57.27 v2(121.67,57.27)
$1N12610: length 2.2
  Top Layer w0.254: R6.2 141.61,68.05 power1.2

## Copper pours and planes (outline as drawn; the poured copper is in the pictures)
GND on Top Layer: -1.91,73.78 151.64,73.78 151.64,-2.04 -1.91,-2.04
GND on Bottom Layer: -1.91,74.03 151.76,74.03 151.76,-2.42 -1.91,-2.42

Small or netless copper shapes (teardrops, artwork), in the pictures only: 101 on Top Layer, 65 on Bottom Layer

## Text on the board
Bottom Silkscreen Layer: 碱基互补配队
Top Silkscreen Layer: PWMA | TX | RX | 3.3 | GN | VM | 2.5 | M+ | B0 | B1 | VC | M- | A4 | A5 | 2.1 | B12 | B11 | A6 | A7 | + | - | Tophan | 碱基互补配队 | →
